# Altium schematic sheet SCH_SIM.SchDoc
size B; SheetNumber: 1; SheetTotal: 1
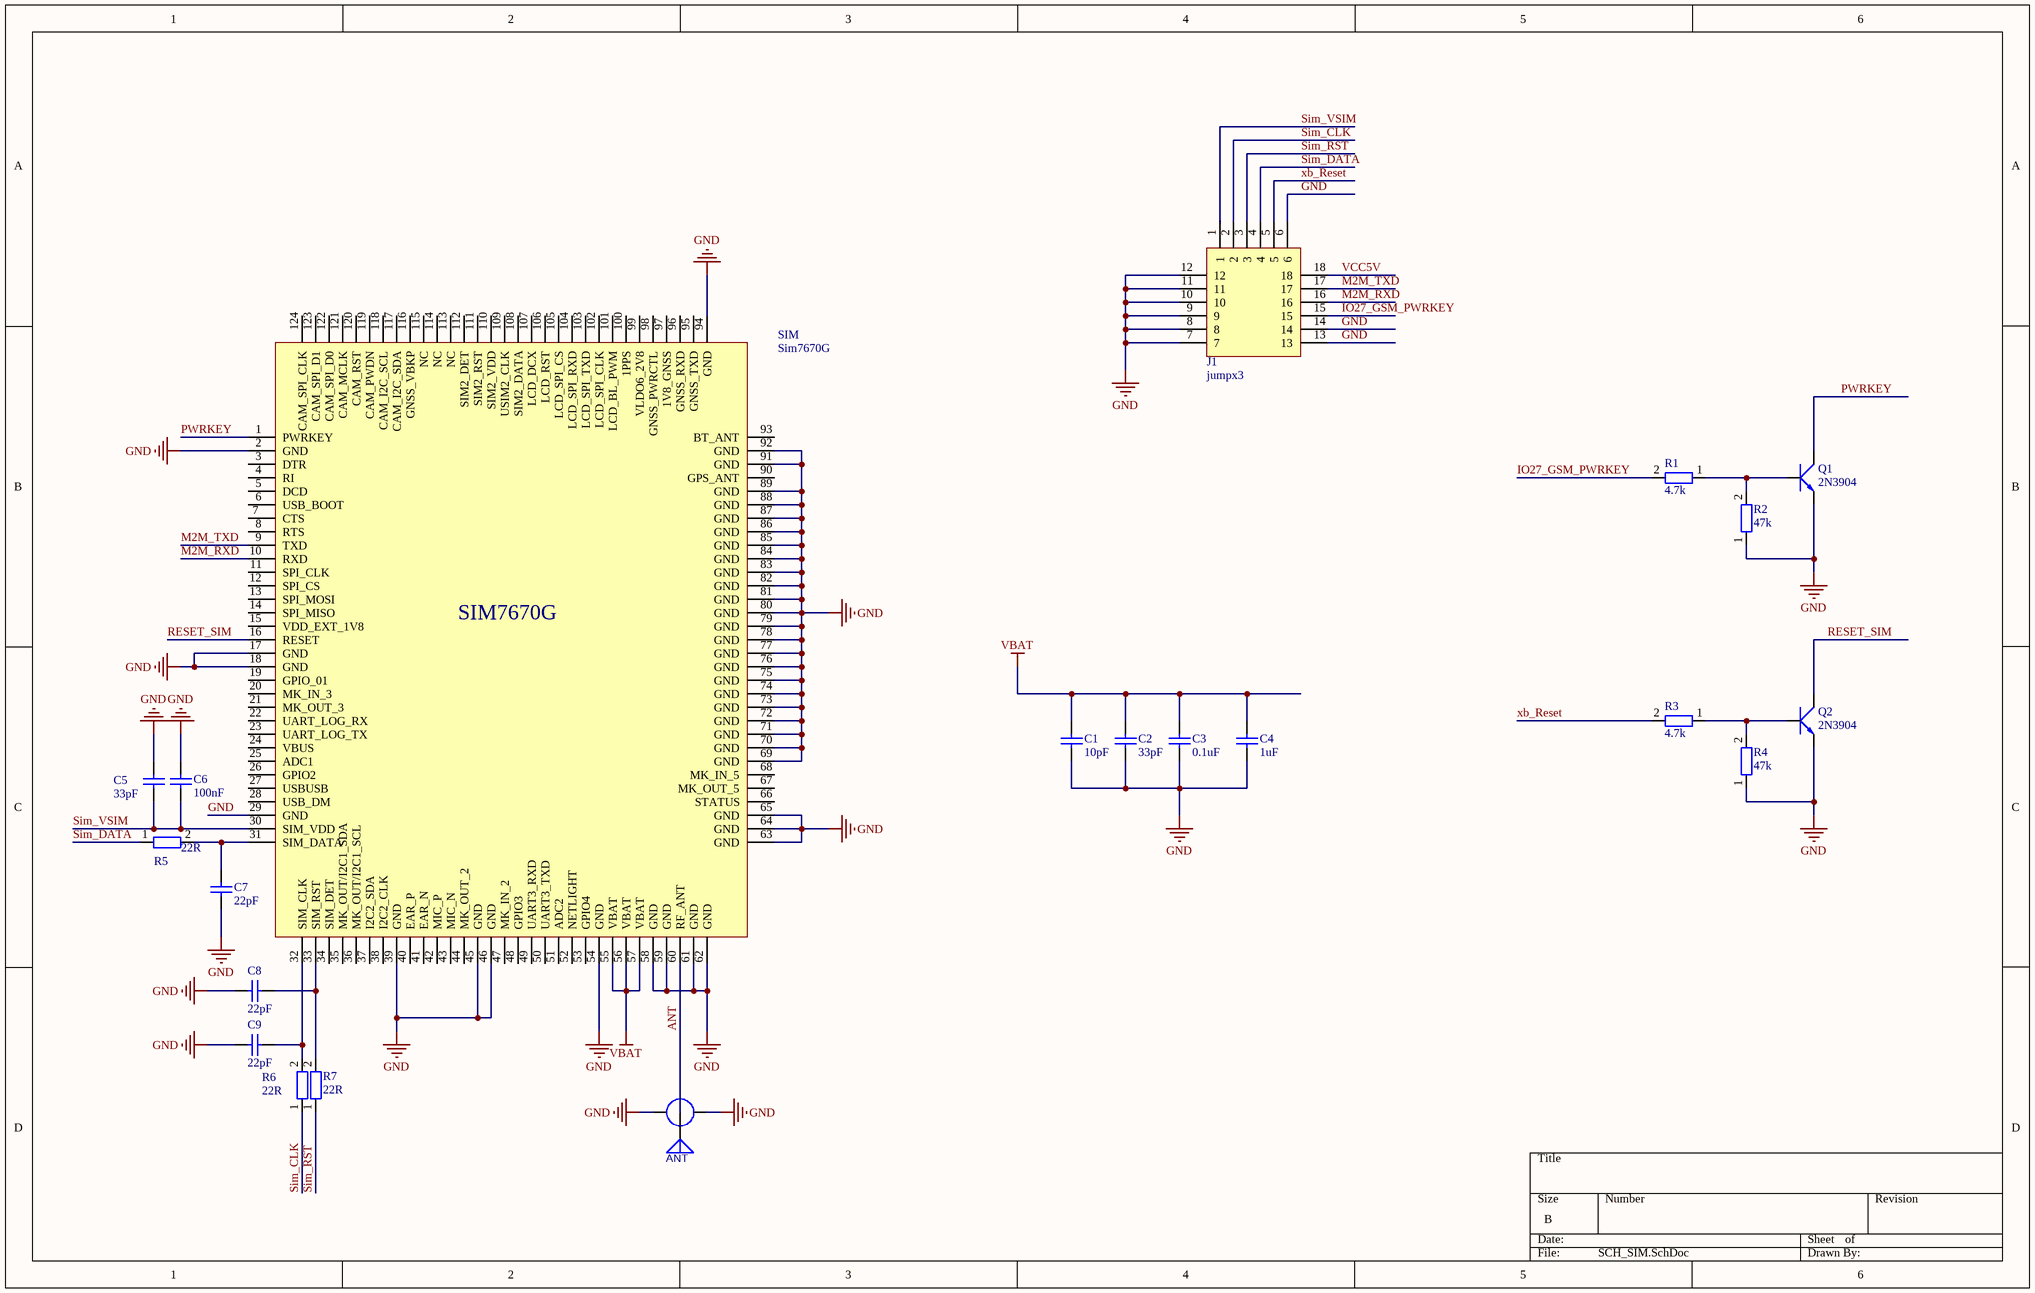
[diagram p0: SCH_SIM.SchDoc]

## Parts
ANT  ANT  [CONNECTORS RF SMD TYPE IPEX]  (value not drawn)
C1  10pF  [C0201]
C2  33pF  [C0201]
C3  0.1uF  [C0201]
C4  1uF  [C0201]
C5  33pF  [C0201]
C6  100nF  [C0201]
C7  22pF  [CAP_0805]
C8  22pF  [C0201]
C9  22pF  [C0201]
J1  jumpx3
Q1  2N3904  [SOT-23]
Q2  2N3904  [SOT-23]
R1  4.7k  [R0201]
R2  47k  [R0201]
R3  4.7k  [R0201]
R4  47k  [R0201]
R5  22R  [R0201]
R6  22R  [R0201]
R7  22R  [R0201]
SIM  Sim7670G  [PCBComponent_1]

## Nets
GND: ANT.2 ANT.3 C1.1 C2.1 C3.1 C4.1 C5.1 C6.1 C7.2 C8.2 C9.2 J1.6 J1.7 J1.8 J1.9 J1.10 J1.11 J1.12 J1.13 J1.14 Q1.2(E) Q2.2(E) R2.1 R4.1 SIM.2(GND) SIM.17(GND) SIM.18(GND) SIM.29(GND) SIM.39(GND) SIM.45(GND) SIM.46(GND) SIM.54(GND) SIM.58(GND) SIM.59(GND) SIM.61(GND) SIM.62(GND) SIM.63(GND) SIM.64(GND) SIM.65(GND) SIM.69(GND) SIM.70(GND) SIM.71(GND) SIM.72(GND) SIM.73(GND) SIM.74(GND) SIM.75(GND) SIM.76(GND) SIM.77(GND) SIM.78(GND) SIM.79(GND) SIM.80(GND) SIM.81(GND) SIM.82(GND) SIM.83(GND) SIM.84(GND) SIM.85(GND) SIM.86(GND) SIM.87(GND) SIM.88(GND) SIM.89(GND) SIM.91(GND) SIM.92(GND) SIM.94(GND)
VBAT: C1.2 C2.2 C3.2 C4.2 SIM.55(VBAT) SIM.56(VBAT) SIM.57(VBAT)
ANT: ANT.1 SIM.60(RF_ANT)
IO27_GSM_PWRKEY: J1.15 R1.2
M2M_RXD: J1.16 SIM.10(RXD)
M2M_TXD: J1.17 SIM.9(TXD)
PWRKEY: Q1.3(C) SIM.1(PWRKEY)
RESET_SIM: Q2.3(C) SIM.16(RESET)
Sim_CLK: J1.2 R6.1
Sim_DATA: J1.4 R5.1
Sim_RST: J1.3 R7.1
Sim_VSIM: C5.2 C6.2 J1.1 SIM.30(SIM_VDD)
VCC5V: J1.18
xb_Reset: J1.5 R3.2
NetC7_1: C7.1 R5.2 SIM.31(SIM_DATA)
NetC8_1: C8.1 R7.2 SIM.33(SIM_RST)
NetC9_1: C9.1 R6.2 SIM.32(SIM_CLK)
NetQ1_1: Q1.1(B) R1.1 R2.2
NetQ2_1: Q2.1(B) R3.1 R4.2

Not connected (* = marked no-connect by the designer): SIM 3(DTR) 4(RI) 5(DCD) 6(USB_BOOT) 7 (CTS) 8(RTS) 11(SPI_CLK) 12(SPI_CS) 13(SPI_MOSI) 14(SPI_MISO) 15(VDD_EXT_1V8) 19(GPIO_01) 20(MK_IN_3) 21(MK_OUT_3) 22(UART_LOG_RX) 23(UART_LOG_TX) 24(VBUS) 25(ADC1) 26(GPIO2) 27(USBUSB) 28(USB_DM) 34(SIM_DET) 35(MK_OUT/I2C1_SDA) 36(MK_OUT/I2C1_SCL) 37(I2C2_SDA) 38(I2C2_CLK) 40(EAR_P) 41(EAR_N) 42(MIC_P) 43(MIC_N) 44(MK_OUT_2) 47(MK_IN_2) 48(GPIO3) 49(UART3_RXD) 50(UART3_TXD) 51(ADC2) 52(NETLIGHT) 53(GPIO4) 66(STATUS) 67(MK_OUT_5) 68(MK_IN_5) 90(GPS_ANT) 93(BT_ANT) 95(GNSS_TXD) 96(GNSS_RXD) 97(1V8_GNSS) 98(GNSS_PWRCTL) 99(VLDO6_2V8) 100(1PPS) 101(LCD_BL_PWM) 102(LCD_SPI_CLK) 103(LCD_SPI_TXD) 104(LCD_SPI_RXD) 105(LCD_SPI_CS) 106(LCD_RST) 107(LCD_DCX) 108(SIM2_DATA) 109(USIM2_CLK) 110(SIM2_VDD) 111(SIM2_RST) 112(SIM2_DET) 113(NC) 114(NC) 115(NC) 116(GNSS_VBKP) 117(CAM_I2C_SDA) 118(CAM_I2C_SCL) 119(CAM_PWDN) 120(CAM_RST) 121(CAM_MCLK) 122(CAM_SPI_D0) 123(CAM_SPI_D1) 124(CAM_SPI_CLK)

## Notes on the sheet
- (in symbol Sim7670G) SIM7670G

## Library data of the parts
ANT = CONNECTORS RF SMD: SMD RF Connectors / Coaxial Connectors ROHS; BOM_Manufacturer: SHOU HAN(首韩); BOM_Manufacturer Part: IPEX1-TXZ 142; Contributor: lcsc; BOM_Supplier: LCSC; BOM_Supplier Part: C3151745; link: https://atta.szlcsc.com/upload/public/pdf/source/20220627/A0C2EF411B6F3EC53ED1A4F491E26EB6.pdf; BOM_JLCPCB Part Class: Extended Part; spicePre: U; spiceSymbolName: IPEX1-TXZ 142
C1-C5 C7-C9 = CAP104-100nF-50V: Capacitor; 104: 100nF
C6 = CAP104-100nF-50V: Capacitor; 104: 100nF
Q1 Q2 = Trans BC817: SOT-23 - C8658; Value: C9014
R1-R7 = RES 0603 1%_: ±1% - Chip Resistor - Surface Mount ROHS; Chung_Loai: Dán; Don_Vi: Con; So_Chan: 2; Ma_Hang: MH005880; Kieu_Chan: *